# Altium schematic sheet PWR_MGMT.SchDoc
size C; SheetNumber: 4; SheetTotal: 5
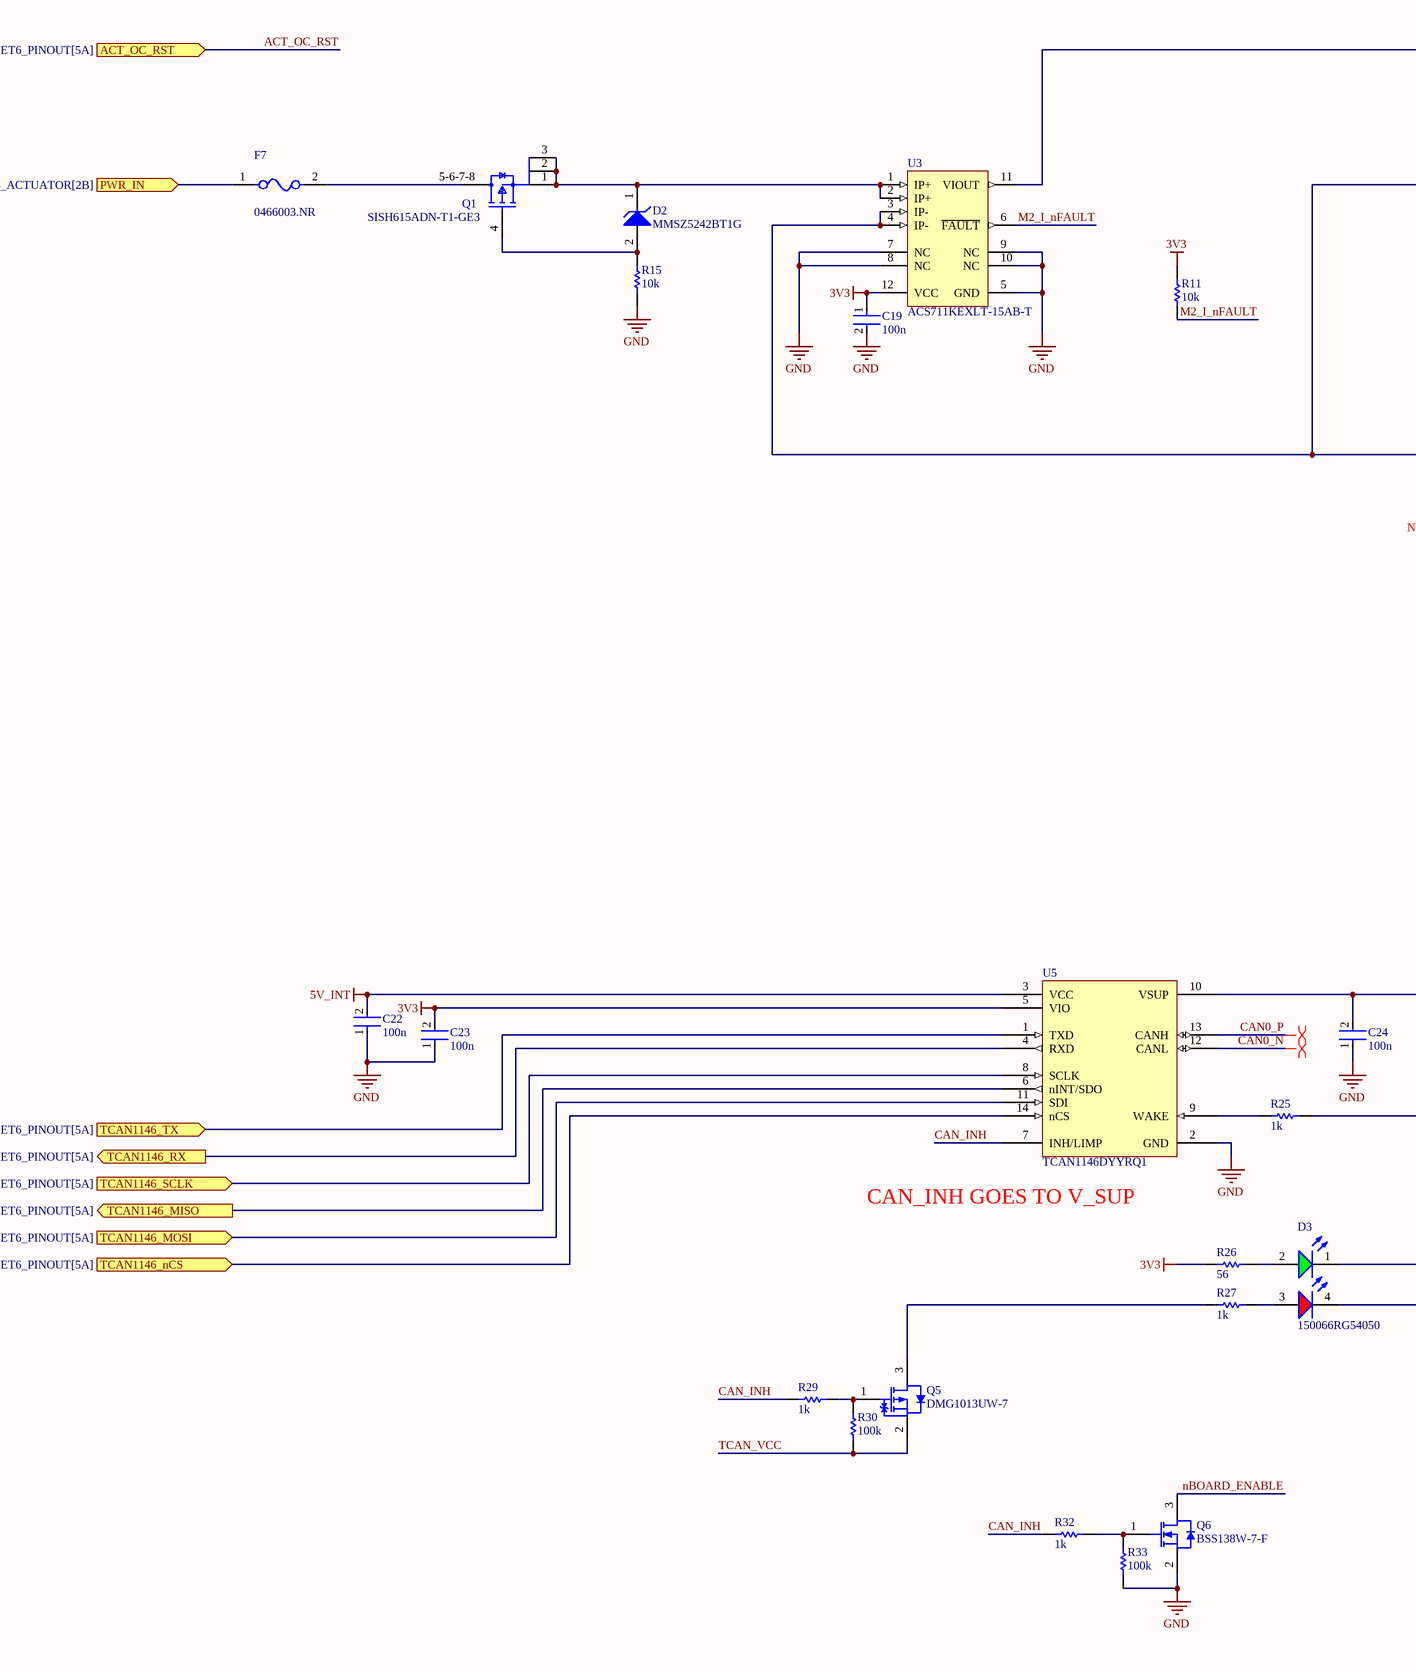
[diagram p0: PWR_MGMT.SchDoc, left]
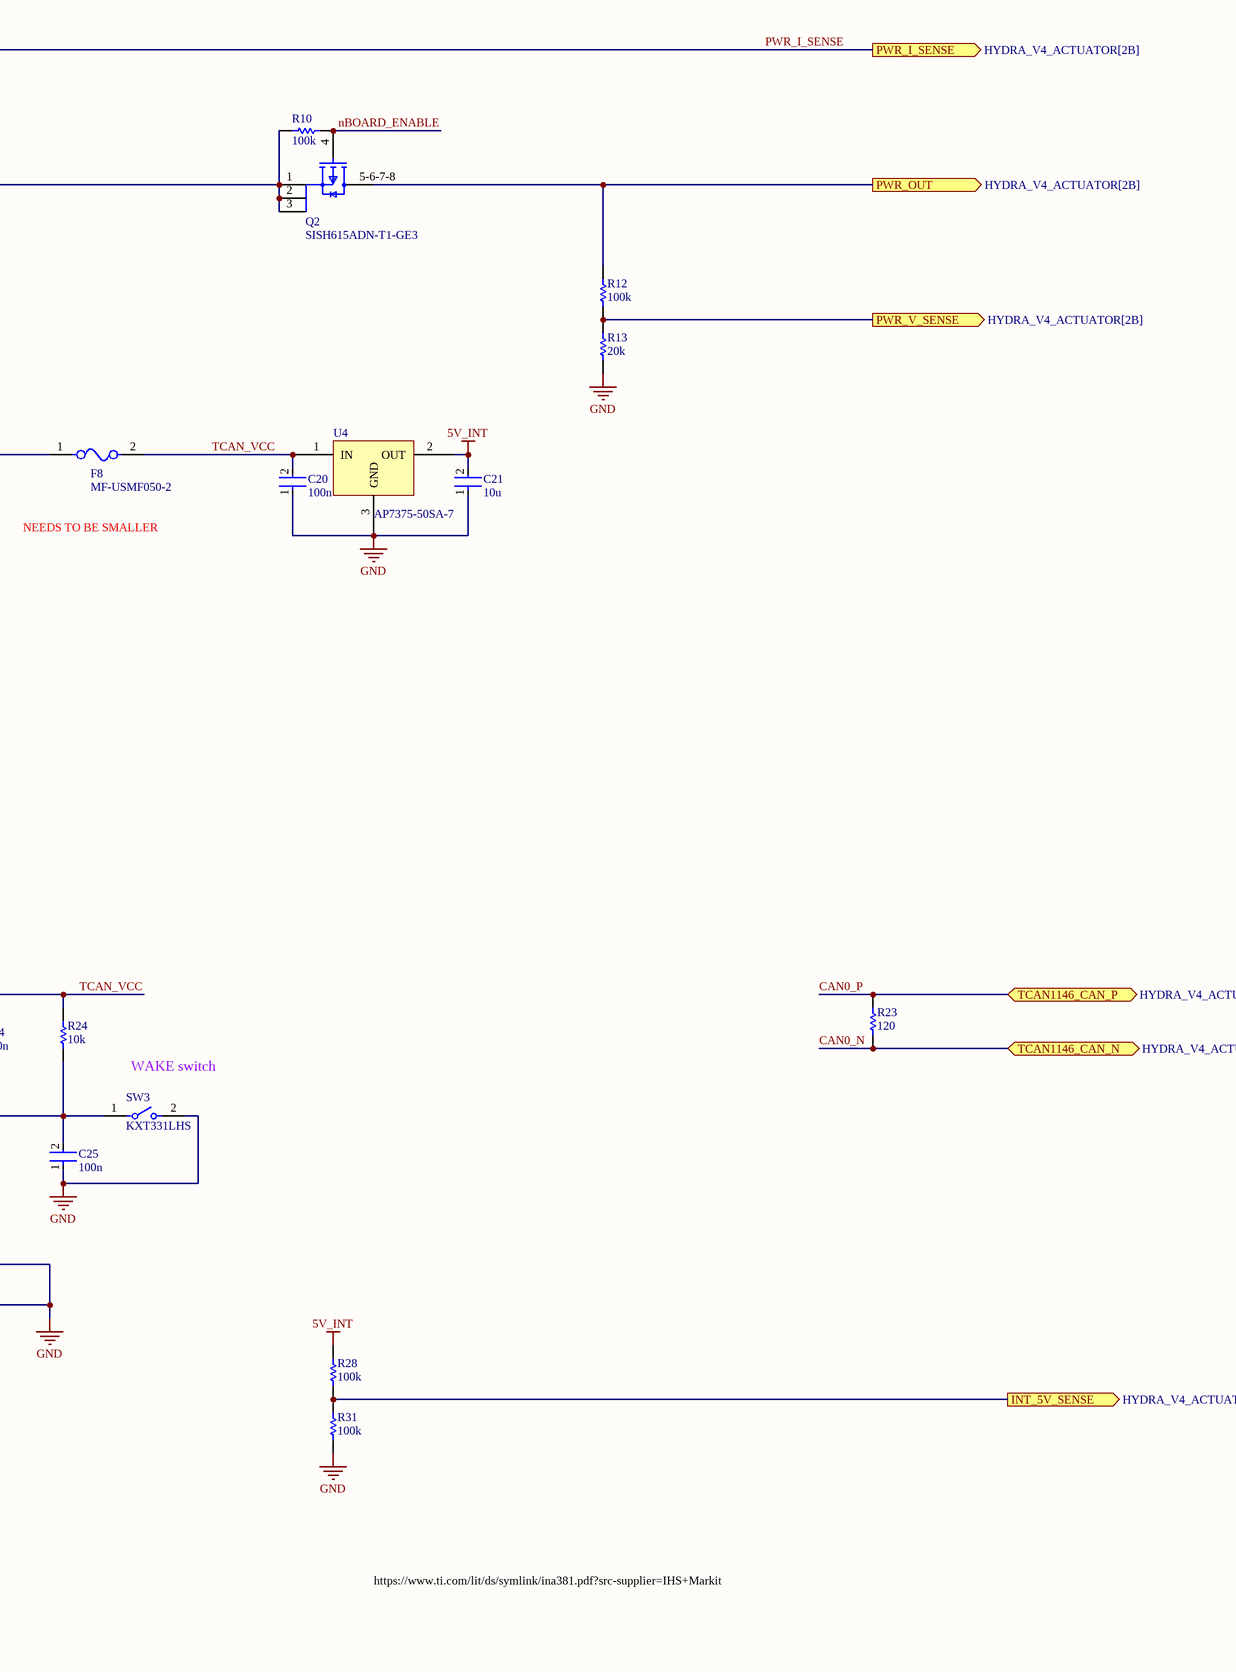
[diagram p1: PWR_MGMT.SchDoc, right]

## Parts
C19  100n  [FP-0402-L_1_0_0_05-W_0_5-IPC_A]
C20  100n  [FP-0402-L_1_0_0_05-W_0_5-IPC_A]
C21  10u  [FP-0402-L_1_0_0_05-W_0_5-IPC_A]
C22  100n  [FP-0402-L_1_0_0_05-W_0_5-IPC_A]
C23  100n  [FP-0402-L_1_0_0_05-W_0_5-IPC_A]
C24  100n  [FP-0402-L_1_0_0_05-W_0_5-IPC_A]
C25  100n  [FP-0402-L_1_0_0_05-W_0_5-IPC_A]
D2  MMSZ5242BT1G  [ONSC-SOD-123-2-425-04_V]
D3  150066RG54050  [WL-SBCD_0606]
F7  0466003.NR  [FP-0466-MFG]
F8  MF-USMF050-2  [FP-MF-USMF-MFG]
Q1  SISH615ADN-T1-GE3  [SISH615ADN-T1-GE3-Footprint-1]
Q2  SISH615ADN-T1-GE3  [SISH615ADN-T1-GE3-Footprint-1]
Q5  DMG1013UW-7  [DIOD-SOT323-3_V]
Q6  BSS138W-7-F  [DIOD-SOT323-3_V]
R10  100k  [R0603B]
R11  10k  [R0603B]
R12  100k  [R0603B]
R13  20k  [R0603B]
R15  10k  [R0603B]
R23  120  [R0603B]
R24  10k  [R0603B]
R25  1k  [R0603B]
R26  56  [R0603B]
R27  1k  [R0603B]
R28  100k  [R0603B]
R29  1k  [R0603B]
R30  100k  [R0603B]
R31  100k  [R0603B]
R32  1k  [R0603B]
R33  100k  [R0603B]
SW3  KXT331LHS  [FP-KXT331LHS-MFG]
U3  ACS711KEXLT-15AB-T  [ALEG-EX-12_V]
U4  AP7375-50SA-7  [AP7375-50SA-7-Footprint-1]
U5  TCAN1146DYYRQ1  [TCAN1146DYYRQ1-Footprint-1]

## Ports
ACT_OC_RST (in, see HYDRA_V4_ACTUATOR[2B], STM32G473CET6_PINOUT[5A]), INT_5V_SENSE (out, see HYDRA_V4_ACTUATOR[2B], STM32G473CET6_PINOUT[5B]), PWR_I_SENSE (out, see HYDRA_V4_ACTUATOR[2B]), PWR_IN (in, see HYDRA_V4_ACTUATOR[2B]), PWR_OUT (out, see HYDRA_V4_ACTUATOR[2B]), PWR_V_SENSE (out, see HYDRA_V4_ACTUATOR[2B]), TCAN1146_CAN_N (bidir, see HYDRA_V4_ACTUATOR[2B]), TCAN1146_CAN_P (bidir, see HYDRA_V4_ACTUATOR[2B]), TCAN1146_MISO (out, see HYDRA_V4_ACTUATOR[2B], STM32G473CET6_PINOUT[5A]), TCAN1146_MOSI (in, see HYDRA_V4_ACTUATOR[2B], STM32G473CET6_PINOUT[5A]), TCAN1146_nCS (in, see HYDRA_V4_ACTUATOR[2B], STM32G473CET6_PINOUT[5A]), TCAN1146_RX (out, see HYDRA_V4_ACTUATOR[2B], STM32G473CET6_PINOUT[5A]), TCAN1146_SCLK (in, see HYDRA_V4_ACTUATOR[2B], STM32G473CET6_PINOUT[5A]), TCAN1146_TX (in, see HYDRA_V4_ACTUATOR[2B], STM32G473CET6_PINOUT[5A])

## Nets
3V3: C19.1 C23.2 R11.2 R26.2 U3.12(VCC) U5.5(VIO)
5V_INT: C21.2 C22.2 R28.2 U4.2(OUT) U5.3(VCC)
GND: C19.2 C20.1 C21.1 C22.1 C23.1 C24.1 C25.1 D3.1(K) D3.4(K) Q6.2(S) R13.1 R15.1 R31.1 R33.1 SW3.2 U3.5(GND) U3.7(NC) U3.8(NC) U3.9(NC) U3.10(NC) U4.3(GND) U5.2(GND)
ACT_OC_RST: port ACT_OC_RST
CAN0_N: R23.1 U5.12(CANL) ; port TCAN1146_CAN_N
CAN0_P: R23.2 U5.13(CANH) ; port TCAN1146_CAN_P
CAN_INH: R29.2 R32.2 U5.7(INH/LIMP)
INT_5V_SENSE: R28.1 R31.2 ; port INT_5V_SENSE
M2_I_nFAULT: R11.1 U3.6(~{FAULT})
nBOARD_ENABLE: Q2.4(G) Q6.3(D) R10.2
PWR_I_SENSE: U3.11(VIOUT) ; port PWR_I_SENSE
PWR_IN: F7.1 ; port PWR_IN
PWR_OUT: Q2.5-6-7-8(D) R12.2 ; port PWR_OUT
PWR_V_SENSE: R12.1 R13.2 ; port PWR_V_SENSE
TCAN1146_MISO: U5.6(nINT/SDO) ; port TCAN1146_MISO
TCAN1146_MOSI: U5.11(SDI) ; port TCAN1146_MOSI
TCAN1146_nCS: U5.14(nCS) ; port TCAN1146_nCS
TCAN1146_RX: U5.4(RXD) ; port TCAN1146_RX
TCAN1146_SCLK: U5.8(SCLK) ; port TCAN1146_SCLK
TCAN1146_TX: U5.1(TXD) ; port TCAN1146_TX
TCAN_VCC: C20.2 C24.2 F8.2 Q5.2(S) R24.2 R30.2 U4.1(IN) U5.10(VSUP)
NetC25_2: C25.2 R24.1 R25.1 SW3.1
NetD2_1: D2.1(K) Q1.1(S) Q1.2(S) Q1.3(S) U3.1(IP+) U3.2(IP+)
NetD2_2: D2.2(A) Q1.4(G) R15.2
NetD3_2: D3.2(A) R26.1
NetD3_3: D3.3(A) R27.1
NetF7_2: F7.2 Q1.5-6-7-8(D)
NetF8_1: F8.1 Q2.1(S) Q2.2(S) Q2.3(S) R10.1 U3.3(IP-) U3.4(IP-)
NetQ5_1: Q5.1(G) R29.1 R30.1
NetQ5_3: Q5.3(D) R27.2
NetQ6_1: Q6.1(G) R32.1 R33.2
NetR25_2: R25.2 U5.9(WAKE)

## Layout directives
differential pair; differential pair class 120DIFF: CAN0_N, CAN0_P

## Notes on the sheet
- NEEDS TO BE SMALLER
- (near SW3) WAKE switch
- (near U5) CAN_INH GOES TO V_SUP
- https://www.ti.com/lit/ds/symlink/ina381.pdf?src-supplier=IHS+Markit

## Library data of the parts
C19-C25 = CMP-001-00058-1: LARGE PADS, 0402 CAP, CHANGE COMMENT TO MATCH REAL P/N; Capacitor Type: Ceramic; Min Operating Temperature: -55°C; Mounting Technology: Surface Mount; Pins: 2; Case/Package: 0402; RoHS Compliant: Yes; Max Operating Temperature: 85°C
D2 = CMP-1060-00565-1: Zener Voltage Regulator, 500 mW, 2-Pin SOD-123, Pb-Free, Tape and Reel; Manufacturer: On Semiconductor; P Max (W): 0.5; VZ Typ (V): 12; PartNumber: MMSZ5242BT1G; PackageReference: SOD-123-2-425-04; ComponentLink3URL: http://www.onsemi.com/pub_link/Collateral/425-04.PDF; Mounting Technology: Surface Mount; ComponentLink2Description: Datasheet; ComponentLink1URL: http://www.onsemi.com/; ComponentLink3Description: Package Specification; PackageDescription: 2-Pin SOD, Body 1.6 x 2.69 mm; PackageVersion: Rev. G, 10/2009; ComponentLink1Description: Manufacturer URL; RoHS: Pb-Free; ComponentLink2URL: http://www.onsemi.com/pub_link/Collateral/MMSZ5221BT1-D.PDF; Packing: Tape and Reel; DatasheetVersion: Rev. 12
D3 = CMP-004-00040-2: Led, Red/Grn, 180Mcd/230Mcd, 624Nm/525Nm Rohs Compliant: Yes; Source: rgled.SchLib; Component Type: Standard; Design Item ID: CMP-004-00034-2; Pins: 4
F7 = CMP-08605-000054-1: FUSE BOARD MNT 3A 32VAC/VDC 1206; Manufacturer: Littelfuse; Fuse Interrupt Ac Current: 50A; Fuse Voltage Drop: 75.99mV; Max Fuse Ac Voltage: 32V; Fuse I2T: 0.576A2Sec; Resistance: 0.019Ω; Fuse Blow Speed: Fast; Value: 0.019Ω; ComponentLink2Description: Datasheet; Fuse Current: 3A; RoHS: TRUE; Mouser Description: Surface Mount Fuses 32V 3A VFA Slimline; Height: 0.66mm; Octopart: https://octopart.com/0466003.nr-littelfuse-565175; Package: 0466; Fuse Interrupt Dc Current: 50A; Manufacturer Part Number: 0466003.NR; Temperature Range Low: -55°C; ComponentLink2URL: https://www.littelfuse.com/~/media/electronics/datasheets/fuses/littelfuse_fuse_466_datasheet.pdf.pdf; Digikey Description: FUSE BOARD MNT 3A 32VAC/VDC 1206; Voltage Rating: 32V; Category: Fuse; Lead Free: Yes; Device Class L2: Fuses; Automotive: No; Max Fuse Dc Voltage: 32V; Temperature Range High: +90°C; Device Class L3: unset; Device Class L1: Circuit Protection; Temperature: -55°C to +90°C
F8 = CMP-07400-000020-1: PTC RESET FUSE 13.2V 500MA 1210; Manufacturer: Bourns Inc.; Value: 0.18-0.9Ω; Trip Current: 1A; Current Rating: 40A; Trip Time: 0.1s; Automotive Grade: Grade 3; Hold Current: 0.5A; Package: MF-USMF; Voltage Rating: 13.2V; Device Class L2: PTC Resettable Fuses; Temperature: -40°C to +85°C; Device Class L1: Circuit Protection; Device Class L3: unset; Height: 0.85mm; ComponentLink2Description: Datasheet; Temperature Range Low: -40°C; Ambient Temperature Range Low: -40°C; Category: Fuse; Lead Free: Yes; Temperature Range High: +85°C; Mouser Description: Resettable Fuses - PPTC 0.50A 13.2V 0.18ohm Hold .5A Trip 1A; Manufacturer Part Number: MF-USMF050-2; Resistance: 0.18-0.9Ω; RoHS: TRUE; Ipc Land Pattern Name: CAPC321258X70; Ambient Temperature Range High: +85°C; Automotive: Yes; Digikey Description: PTC RESET FUSE 13.2V 500MA 1210; Octopart: https://octopart.com/mf-usmf050-2-bourns-97645; ComponentLink2URL: https://www.bourns.com/docs/Product-Datasheets/mfusmf.pdf
Q1 Q2 = CMP-013-00018-2: Trans MOSFET P-CH 20V 22.1A 8-Pin PowerPAK 1212 EP T/R; Source: SISH615ADN-T1-GE3.SchLib; Design Item ID: CMP-013-00036-4; Component Type: Standard; Pins: 5
Q5 = CMP-2000-06170-1: P-Channel Enhancement Mode MOSFET, 310 mW, 20 V, -55 to 150 degC, 3-Pin SOT-323, RoHS, Tape and Reel; Manufacturer: Diodes Inc; Qg Gate Charge: 0.622nC; Drain-Source On Resistance-Max: 750mO; Rated Power Dissipation: 310mW; Drain-to-Source Voltage [Vdss]: 20V; Package Reference: SOT323; Datasheet Version: Rev. 3-2, 09/2013; Package Description: 3-Pin Small Outline Transistor, Body 2 x 1.25 mm, Pitch 0.65 mm; Mounting Technology: SurfaceMount; Manufacturer URL: http://www.diodes.com/; Datasheet URL: http://www.diodes.com/_files/datasheets/ds31861.pdf; Channel Type: P-Channel
Q6 = CMP-2000-05968-1: N-Channel Enhancement Mode Mosfet, 50 V, 200 mA, -55 to 150 degC, 6-Pin SOT-323, RoHS, Tape and Reel; Typical Turn-Off Delay Time: 20ns; Number of Channels: 1Channel; Type: EnhancementModeFieldEffectTransistor; Brand: DiodesIncorporated; Vds - Drain-Source Breakdown Voltage: 75V; Vgs - Gate-Source Voltage: 20V; Rds On - Drain-Source Resistance: 1.4Ohms; Transistor Type: 1N-Channel; Configuration: Single; Unit Weight: 0.000212oz; Pd - Power Dissipation: 200mW; Id - Continuous Drain Current: 200mA; Forward Transconductance - Min: 0.1S; Manufacturer URL: http://www.diodes.com/; Series: BSS138; Package Description: 3-Pin Small Outline Transistor, Body 2 x 1.25 mm, Pitch 0.65 mm; Mounting Technology: SurfaceMount; Product Category: MOSFET; RoHS: True; Maximum Operating Temperature: +150C; Height: 1mm; Length: 2.2mm; Technology: Si; Width: 1.35mm; Datasheet URL: http://www.diodes.com/_files/datasheets/ds30206.pdf; Manufacturer: DiodesIncorporated; Package / Case: SOT-323-3; Typical Turn-On Delay Time: 20ns; Transistor Polarity: N-Channel; Factory Pack Quantity: 3000; Packaging: Reel; Product: MOSFETSmallSignal; Datasheet Version: Rev. 11-2, 09/2013; Package Reference: SOT323; Minimum Operating Temperature: -55C; Mounting Style: SMD/SMT; Channel Mode: Enhancement
R10-R13 R15 R23-R33 = CMP-009-00002-14: Resistor
SW3 = CMP-10040-000029-1: SWITCH TACTILE SPST-NO 0.02A 15V; Operating Force: 240gf; Switch Travel: 0.13mm; Illumination Type: Non-Illuminated; Throw Configuration: SPST; Number of Ports: 1; Current Rating: 5A; Mechanical Life: 500000Cycles; Switch Function: Off-Mom; Connector Type: USB; Actuator Type: Standard; Gender: Receptacle; Number of Contacts: 24; Contact Plating: Gold; Insulation Color: Black; Min Operating Temperature: -40°C; Packaging: Tape and Reel; Flammability Rating: UL94 V-0; Max Operating Temperature: 85°C; Termination: Solder; Mount: Surface Mount
U3 = CMP-1557-00001-1: Hall Effect Linear Current Sensor with Overcurrent Fault Output for <100 V Isolation Applications, 3 to 5.5 V, -15.5 to 15.5 A IP, -40 to 125 degC, 12-Pin QFN (EX), RoHS, Tape and Reel; VCC Max: 5.5 V; IP Max: 15.5 A; VCC Min: 3 V; IP Min: -15.5 A; -3dB Bandwidth: 0.1 MHz; PackageDescription: 12-Pin Quad Flat No-Lead, Body 3 x 3 mm, Height 0.8 mm; ComponentLink1URL: http://www.allegromicro.com/; Packing: Tape and Reel; ComponentLink2URL: http://www.allegromicro.com/~/media/Files/Datasheets/ACS711-Datasheet.ashx?la=en; DatasheetVersion: Rev. 3; PartNumber: ACS711KEXLT-15AB-T; ComponentLink2Description: Datasheet; ComponentLink3URL: http://www.allegromicro.com/~/media/Files/Datasheets/ACS711-Datasheet.ashx?la=en; RoHS: TRUE; ComponentLink1Description: Manufacturer URL; ComponentLink3Description: Package Specification; Temperature Max: 125 degC; Mounting Technology: Surface Mount; Temperature Min: -40 degC
U4 = CMP-019-00041-1: Ldo Cmos Lowcurr SOT23 T&r 3K
U5 = CMP-318-000000-2: Automotive CAN FD transceiver with watchdog, bus diagnostics and partial networking via sele 14-SOT-23-THIN -40 to 150; Component Type: Standard; Design Item ID: CMP-015-00012-2; Pin Count: 14; Source: TCAN1146DYYRQ1.SchLib